# Altium schematic sheet 海关全向控制器主控板电路V3_电源管理.SchDoc
size A4
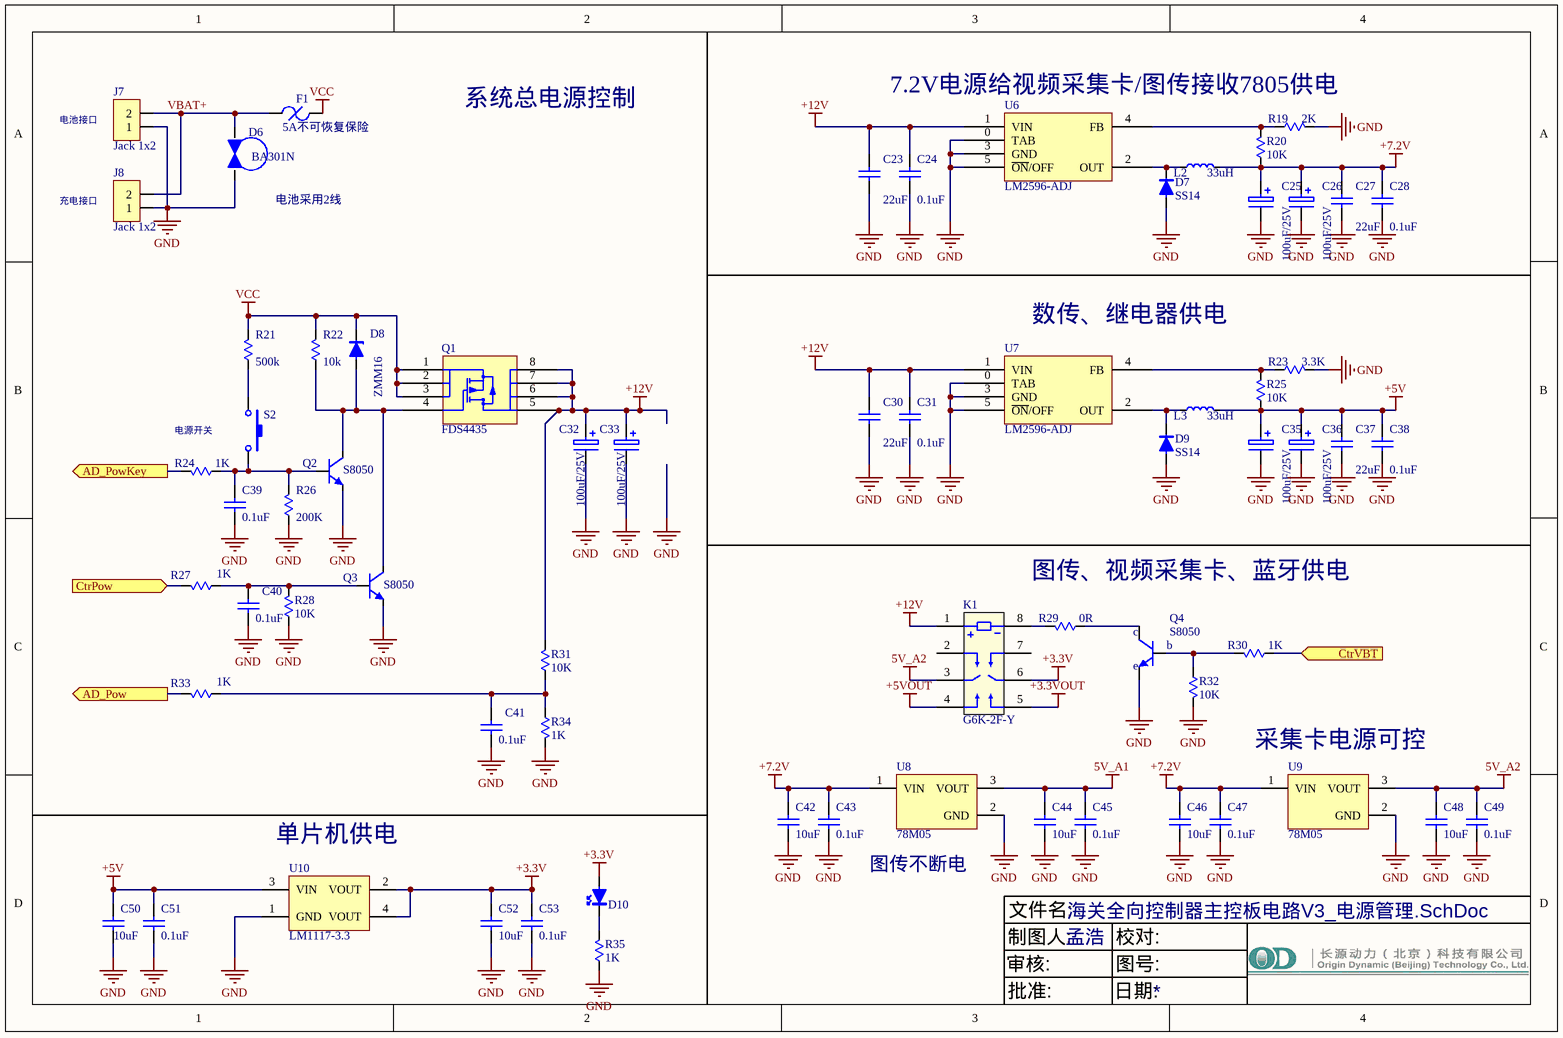
[diagram p0: 海关全向控制器主控板电路V3_电源管理.SchDoc]

## Parts
C23  22uF  [C1210]
C24  0.1uF  [C0805]
C25  100uF/25V  [C7343]
C26  100uF/25V  [C7343]
C27  22uF  [C1210]
C28  0.1uF  [C0805]
C30  22uF  [C1210]
C31  0.1uF  [C0805]
C32  100uF/25V  [C7343]
C33  100uF/25V  [C7343]
C35  100uF/25V  [C7343]
C36  100uF/25V  [C7343]
C37  22uF  [C1210]
C38  0.1uF  [C0805]
C39  0.1uF  [C0805]
C40  0.1uF  [C0805]
C41  0.1uF  [C0805]
C42  10uF  [C0805]
C43  0.1uF  [C0805]
C44  10uF  [C0805]
C45  0.1uF  [C0805]
C46  10uF  [C0805]
C47  0.1uF  [C0805]
C48  10uF  [C0805]
C49  0.1uF  [C0805]
C50  10uF  [C0805]
C51  0.1uF  [C0805]
C52  10uF  [C0805]
C53  0.1uF  [C0805]
D6  BA301N  [BA301N]
D7  SS14  [SMA]
D8  ZMM16  [SOD-80-S]
D9  SS14  [SMA]
D10  LED  [LED0603]  (value not drawn)
F1  5A不可恢复保险  [F1808]
J7  Jack 1x2  [35363-0260]
J8  Jack 1x2  [35363-0260]
K1  G6K-2F-Y  [G6K-2F-Y]
L2  33uH  [L6.6*7.1mm]
L3  33uH  [L6.6*7.1mm]
Q1  FDS4435  [SO8]
Q2  S8050  [SOT-23]
Q3  S8050  [SOT-23]
Q4  S8050  [SOT-23]
R19  2K  [R0805]
R20  10K  [R0805]
R21  500k  [R0805]
R22  10k  [R0805]
R23  3.3K  [R0805]
R24  1K  [R0805]
R25  10K  [R0805]
R26  200K  [R0805]
R27  1K  [R0805]
R28  10K  [R0805]
R29  0R  [R0805]
R30  1K  [R0805]
R31  10K  [R0805]
R32  10K  [R0805]
R33  1K  [R0805]
R34  1K  [R0805]
R35  1K  [R0805]
S2  SW-PB  [ZH-2AWD]  (value not drawn)
U6  LM2596-ADJ  [TO-263-5]
U7  LM2596-ADJ  [TO-263-5]
U8  78M05  [TO-252]
U9  78M05  [TO-252]
U10  LM1117-3.3  [SOT-223]

## Ports
AD_Pow (out), AD_PowKey (out), CtrPow (in), CtrVBT (in)

## Nets
5V_A1: C44.1 C45.2 U8.3(VOUT)
5V_A2: C48.1 C49.2 K1.3 U9.3(VOUT)
+3.3V: C52.1 C53.2 D10.1(A) K1.6 U10.2(VOUT) U10.4(VOUT)
+3.3VOUT: K1.5
+5V: C35.1 C36.1 C37.1 C38.2 C50.1 C51.2 L3.2 R25.1 U10.3(VIN)
+5VOUT: K1.4
+7.2V: C25.1 C26.1 C27.1 C28.2 C42.1 C43.2 C46.1 C47.2 L2.2 R20.1 U8.1(VIN) U9.1(VIN)
+12V: C23.1 C24.2 C30.1 C31.2 C32.1 C33.1 K1.1 Q1.5 Q1.6 Q1.7 Q1.8 R31.1 U6.1(VIN) U7.1(VIN)
GND: C23.2 C24.1 C25.2 C26.2 C27.2 C28.1 C30.2 C31.1 C32.2 C33.2 C35.2 C36.2 C37.2 C38.1 C39.1 C40.1 C41.1 C42.2 C43.1 C44.2 C45.1 C46.2 C47.1 C48.2 C49.1 C50.2 C51.1 C52.2 C53.1 D6.2 D7.1(A) D9.1(A) J7.1 J8.1 Q2.2(E) Q3.2(E) Q4.2(e) R19.2 R23.2 R26.2 R28.2 R32.2 R34.1 R35.1 U6.0(TAB) U6.3(GND) U6.5(~{ON}/OFF) U7.0(TAB) U7.3(GND) U7.5(~{ON}/OFF) U8.2(GND) U9.2(GND) U10.1(GND)
VCC: D8.2(K) F1.2 Q1.1 Q1.2 Q1.3 R21.2 R22.2
AD_Pow: R33.1 ; port AD_Pow
AD_PowKey: R24.1 ; port AD_PowKey
CtrPow: R27.1 ; port CtrPow
CtrVBT: R30.1 ; port CtrVBT
VBAT+: D6.1 F1.1 J7.2 J8.2
NetC39_2: C39.2 Q2.1(B) R24.2 R26.1 S2.2
NetC40_2: C40.2 Q3.1(B) R27.2 R28.1
NetC41_2: C41.2 R31.2 R33.2 R34.2
NetD7_2: D7.2(K) L2.1 U6.2(OUT)
NetD8_1: D8.1(A) Q1.4 Q2.3(C) Q3.3(C) R22.1
NetD9_2: D9.2(K) L3.1 U7.2(OUT)
NetD10_2: D10.2(K) R35.2
NetK1_8: K1.8 R29.2
NetQ4_1: Q4.1(b) R30.2 R32.1
NetQ4_3: Q4.3(c) R29.1
NetR19_1: R19.1 R20.2 U6.4(FB)
NetR21_1: R21.1 S2.1
NetR23_1: R23.1 R25.2 U7.4(FB)

Not connected (* = marked no-connect by the designer): K1 2 7

## Notes on the sheet
- 系统总电源控制
- (near U6) 7.2V电源给视频采集卡/图传接收7805供电
- 电池接口
- 充电接口
- (near D6) 电池采用2线
- (near U7) 数传、继电器供电
- (near R24) 电源开关
- 图传、视频采集卡、蓝牙供电
- (near U9) 采集卡电源可控
- (near U10) 单片机供电
- 图传不断电
- 文件名:
- 审核:
- 制图人:
- 孟浩
- 校对:
- 图号:
- 批准:
- 日期:

## Library data of the parts
C23 C24 C27 C28 C30 C31 C37-C53 = CAP: Published: 8-Jun-2000; LatestRevisionDate: 17-Jul-2002; LatestRevisionNote: Re-released for DXP Platform.; PackageReference: RAD-0.3; Publisher: Altium Limited
  C23 C27 C30 C37: Value: 22uF
  C24 C28 C31 C38-C41 C43 C45 C47 C49 C51 C53: Value: 0.1uF
  C42 C44 C46 C48 C50 C52: Value: 10uF
C25 C26 C35 C36 = ELECTRO: Electrolytic Capacitor
C32 C33 = Cap Poll
D7 D9 = Diode-Switch: Silicon Epitaxial Planar Diodes
D8 = DIODE-ZENER: Small Signal Zener Diodes
F1 = Fuse2
J7 J8 = Jack 1x2: 插座
L2 L3 = INDUCTOR: Code_IEC: 1005; Published: 8-Jun-2000; LatestRevisionDate: 17-Jul-2002; LatestRevisionNote: Re-released for DXP Platform.; PackageReference: 0402-A; Publisher: Altium Limited; Code_JEITA: 0402; Value: 33uH
Q2 Q3 = NPN: NPN General Purpose Amplifier; Published: 8-Jun-2000; LatestRevisionDate: 15-Jan-2003; LatestRevisionNote: PCB Footprint 'BCY-W3/D4.7' replaced; DatasheetDocument: 1997; PackageDocument: Sep-1998; PackageReference: TO-92A; Publisher: Altium Limited; Code_JEDEC: TO-92A; ComponentLink1Description: Manufacturer Link; ComponentLink1URL: http://www.fairchildsemi.com/; ComponentLink2Description: Datasheet; ComponentLink2URL: http://www.fairchildsemi.com/ds/2N%2F2N3904.pdf
Q4 = S8050: NPN triode, 0.5A Max
R19 R20 R23 R25 R29 R30 R32 = RES: Resistor; Published: 8-Jun-2000; LatestRevisionDate: 17-Jul-2002; LatestRevisionNote: Re-released for DXP Platform.; PackageReference: AXIAL-0.3; Publisher: Altium Limited
  R19: Value: 2K
  R20 R25: Value: 10K
  R23: Value: 3.3K
R21 R22 R24 R26-R28 R31 R33-R35 = Res: Resistor; Published: 8-Jun-2000; LatestRevisionDate: 04-Mar-2005; LatestRevisionNote: PCB Footprint replaced.; PackageReference: J1-0603; Publisher: Altium Limited
  R21: Value: 500k
  R22: Value: 10k
  R26: Value: 200K
  R27 R33-R35: Value: 1K
  R28 R31: Value: 10K
S2 = SW-PB: Switch; Published: 24-Mar-1999; LatestRevisionDate: 17-Jul-2002; LatestRevisionNote: Re-released for DXP Platform.; PackageReference: SPST-2; Publisher: Altium Limited; PackageDescription: Switch; 2 Leads
U6 U7 = LM25x6-5: LM2596-5;LM2576-5
U10 = LM1117: 800mA Linear Voltage Regulator